# EAGLE design SwitchPi-v0.1 (EAGLE 6.4)
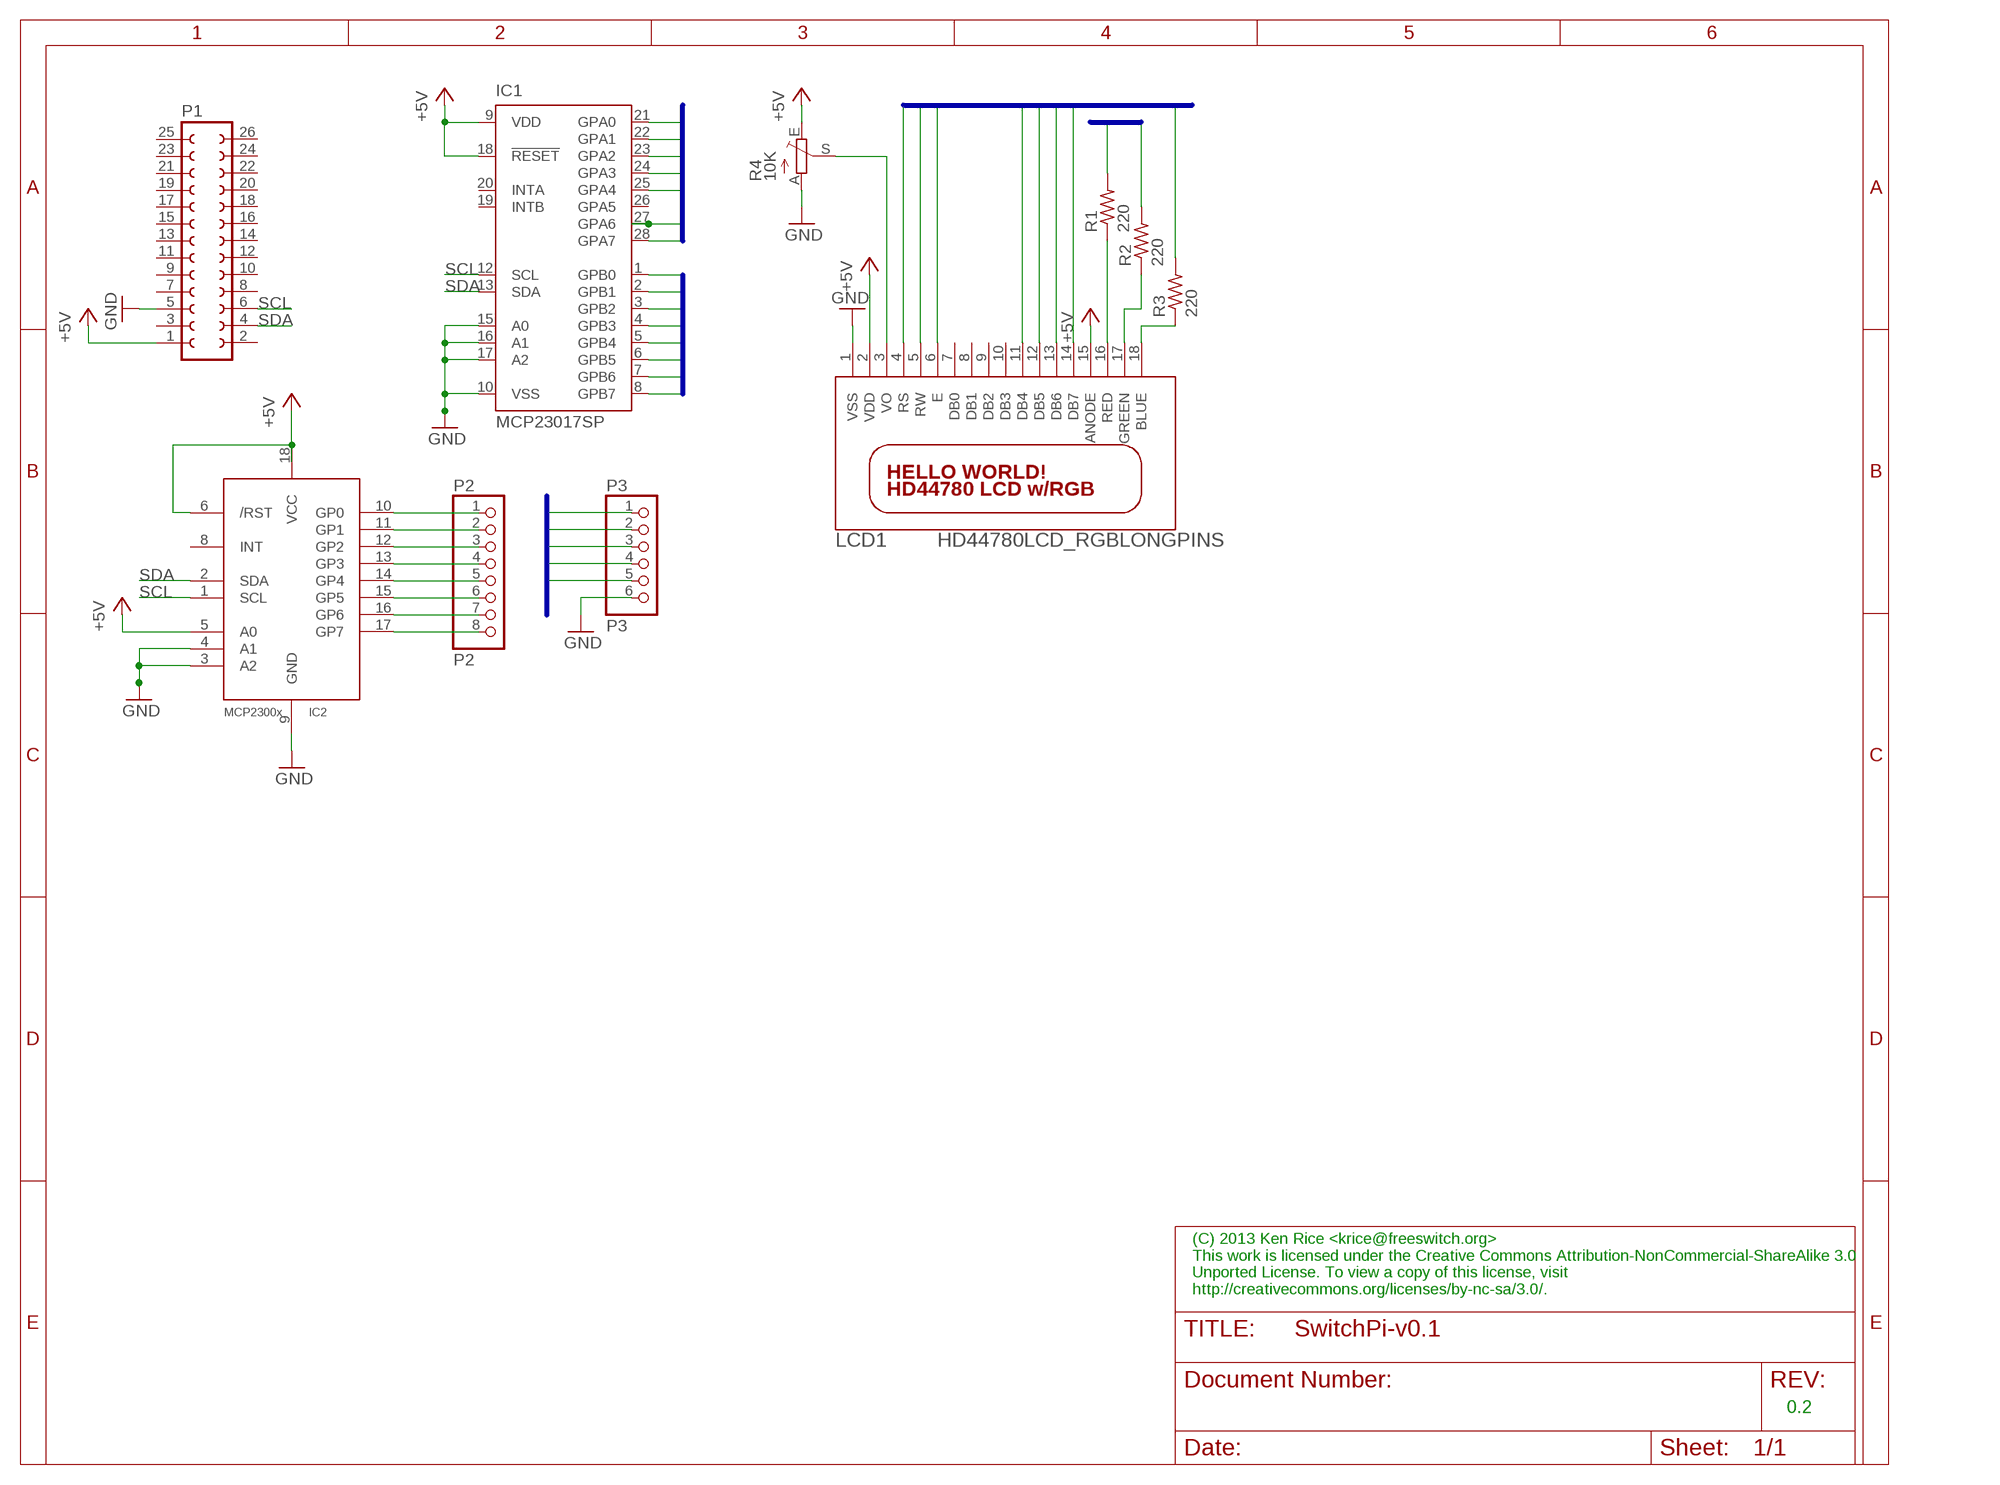
[diagram p0: schematic, sheet 1]

## Parts
IC1  MCP23017SP  [DIL28-3]
IC2  MCP2300X/P  [DIL18]
LCD1  HD44780LCD_RGBLONGPINS  [LCD1602-RGB]
P1  FE13-2  [FE13-2]
P2  P2  PINHD-1X8BIG  [1X08-BIG]
P3  P3  PINHD-1X6  [1X06]
R1  220  R-US_0207/10  [0207/10]
R2  220  R-US_0207/10  [0207/10]
R3  220  R-US_0207/10  [0207/10]
R4  10K  TRIM_EU-CA6V  [CA6V]

## Nets
+5V: IC1.9(VDD) IC1.18(!RESET) IC2.5(A0) IC2.6(/RST) IC2.18(VCC) LCD1.2(VDD) LCD1.15(ANODE) P1.1 R4.E
GND: IC1.10(VSS) IC1.15(A0) IC1.16(A1) IC1.17(A2) IC2.3(A2) IC2.4(A1) IC2.9(GND) LCD1.1(VSS) P1.5 P3.6 R4.A
GPA0: IC1.21(GPA0) P3.1
GPA1: IC1.22(GPA1) P3.2
GPA2: IC1.23(GPA2) P3.3
GPA3: IC1.24(GPA3) P3.4
GPA4: IC1.25(GPA4) P3.5
GPA6: IC1.27(GPA6) R1.2
GPA7: IC1.28(GPA7) R2.2
GPB0: IC1.1(GPB0) R3.2
GPB1: IC1.2(GPB1) LCD1.14(DB7)
GPB2: IC1.3(GPB2) LCD1.13(DB6)
GPB3: IC1.4(GPB3) LCD1.12(DB5)
GPB4: IC1.5(GPB4) LCD1.11(DB4)
GPB5: IC1.6(GPB5) LCD1.6(E)
GPB6: IC1.7(GPB6) LCD1.5(RW)
GPB7: IC1.8(GPB7) LCD1.4(RS)
N$1: IC2.10(GP0) P2.1
N$2: IC2.11(GP1) P2.2
N$3: LCD1.3(VO) R4.S
N$4: IC2.12(GP2) P2.3
N$5: LCD1.16(RED) R1.1
N$6: IC2.13(GP3) P2.4
N$7: IC2.14(GP4) P2.5
N$8: IC2.15(GP5) P2.6
N$9: IC2.16(GP6) P2.7
N$10: IC2.17(GP7) P2.8
N$13: LCD1.17(GREEN) R2.1
N$14: LCD1.18(BLUE) R3.1
SCL: IC1.12(SCL) IC2.1(SCL) P1.6
SDA: IC1.13(SDA) IC2.2(SDA) P1.4
Unconnected: IC1.19(INTB) IC1.20(INTA) IC1.26(GPA5) IC2.8(INT) LCD1.7(DB0) LCD1.8(DB1) LCD1.9(DB2) LCD1.10(DB3) P1.2 P1.3 P1.7 P1.8 P1.9 P1.10 P1.11 P1.12 P1.13 P1.14 P1.15 P1.16 P1.17 P1.18 P1.19 P1.20 P1.21 P1.22 P1.23 P1.24 P1.25 P1.26

## Buses
GPA[0..7]
GPB[0..7]

## Notes on the sheet
- (C) 2013 Ken Rice <krice@freeswitch.org>
  This work is licensed under the Creative Commons Attribution-NonCommercial-ShareAlike 3.0 
  Unported License. To view a copy of this license, visit
  http://creativecommons.org/licenses/by-nc-sa/3.0/.
- 0.2

## Library data of the parts
IC1 = microchip:MCP23017: http://ww1.microchip.com/downloads/en/DeviceDoc/21952a.pdf Source: http://ww1.microchip.com/downloads/en/DeviceDoc/21952a.pdf; MF: MICROCHIP; MPN: MCP23017-E/SP; OC_FARNELL: 1332088; OC_NEWARK: 31K2959
IC2 = adafruit:MCP2300X: MCP23008 Inexpensive i2c i/o expander - 8 general purpose i/o pins with optional pullups
LCD1 = adafruit:HD44780LCD_RGB
P1 = con-lsta:FE13-2: FEMALE HEADER; OC_FARNELL: unknown; OC_NEWARK: unknown
P2 = adafruit:PINHD-1X8: PIN HEADER
P3 = adafruit:PINHD-1X6: PIN HEADER
R1-R3 = resistor:R-US_: RESISTOR, American symbol
R4 = pot:TRIM_EU-: POTENTIOMETER

## Board
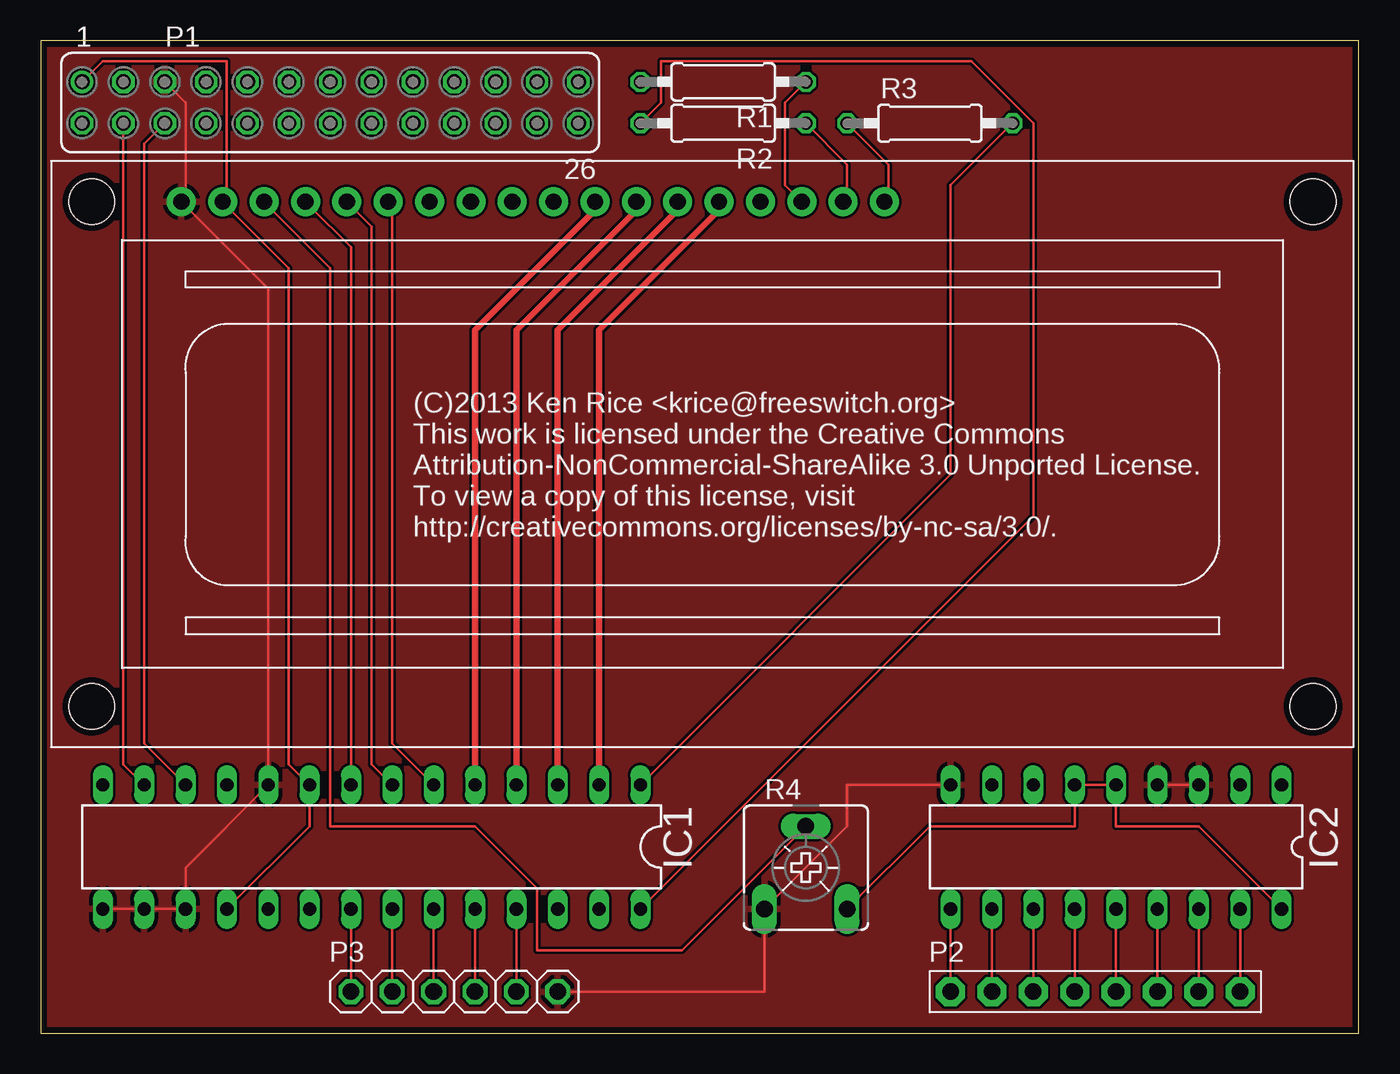
[diagram p1: board, top side]
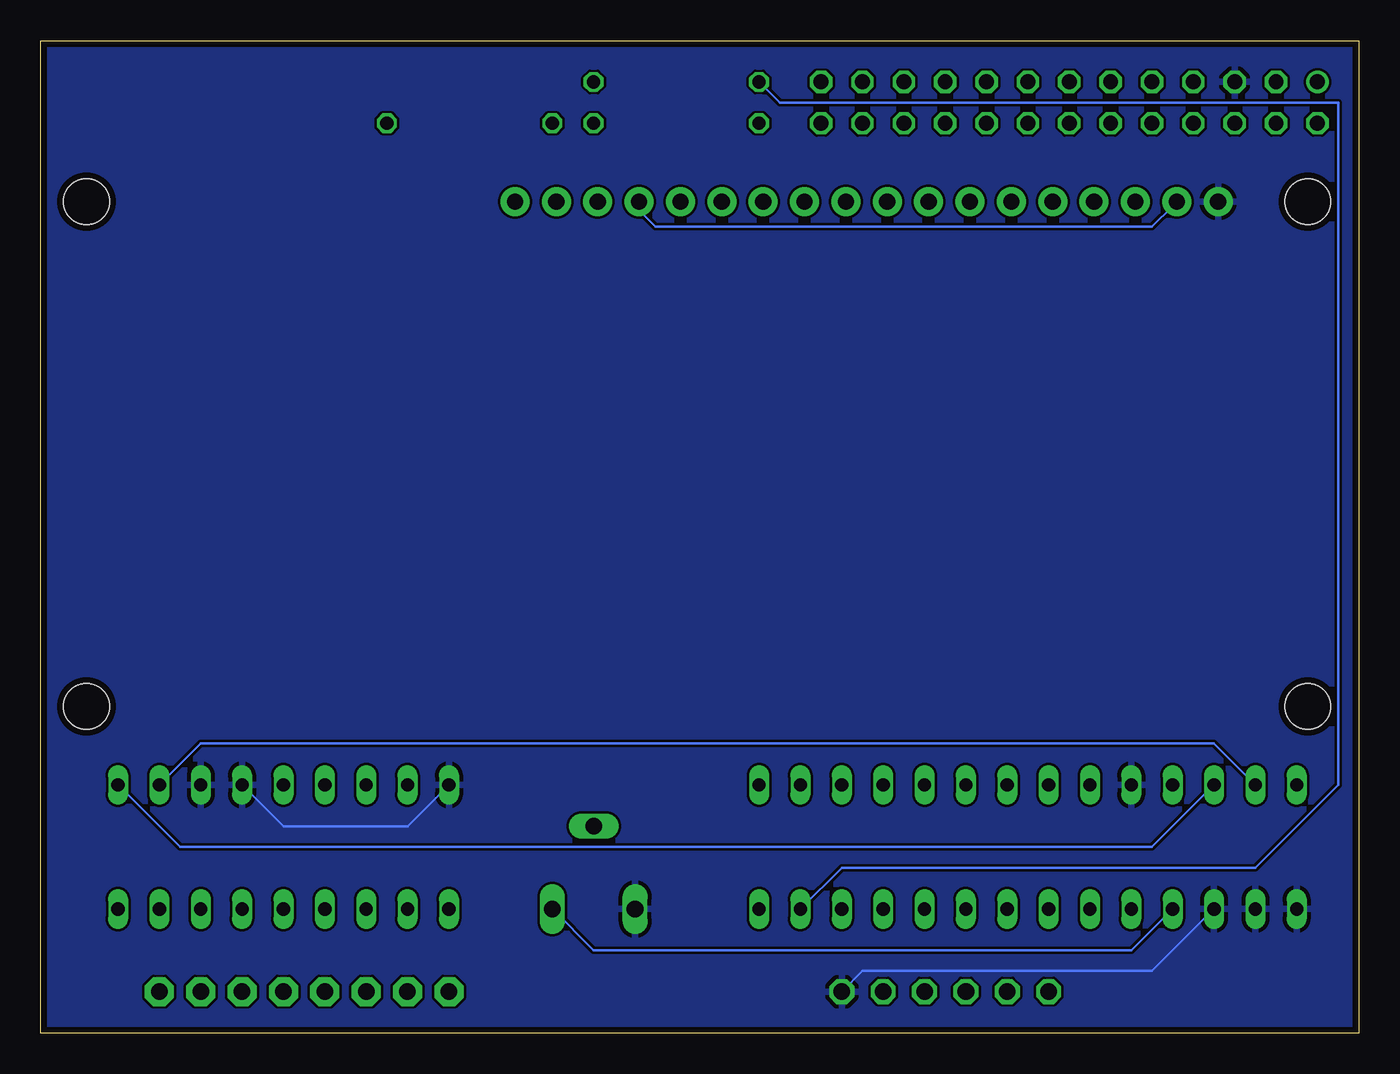
[diagram p2: board, bottom side, seen from below]

Size 80.95 x 60.95 mm. Coordinates in mm from the lower left corner, seen from the top.
Outline: 0,0 80.95,0 80.95,60.95 0,60.95 0,0
Copper layers (1*16): Top 0.0356mm / dielectric 1.5011mm / Bottom 0.0356mm
Design rules "LaenPCBOrder": minimum track width 6mil, minimum drill 13mil, track to track 6mil, track to pad 6mil, pad to pad 6mil, via to via 6mil, smd to smd 6mil, copper to edge 15mil, drill to drill 6mil, minimum pad ring 7mil, minimum via ring 7mil, stop-mask expansion 4mil, vias tented up to drill 0mil, thermal gap 10mil

### Footprints (pad centres in the part's own frame; a part is rotated, then mirrored left to right if it is on the bottom)
DIL28-3 = drill 0.813 long: 1 -16.51,-3.81; 2 -13.97,-3.81; 3 -11.43,-3.81; 4 -8.89,-3.81; 5 -6.35,-3.81; 6 -3.81,-3.81; 7 -1.27,-3.81; 8 1.27,-3.81; 9 3.81,-3.81; 10 6.35,-3.81; 11 8.89,-3.81; 12 11.43,-3.81; 13 13.97,-3.81; 14 16.51,-3.81; 15 16.51,3.81; 16 13.97,3.81; 17 11.43,3.81; 18 8.89,3.81; 19 6.35,3.81; 20 3.81,3.81; 21 1.27,3.81; 22 -1.27,3.81; 23 -3.81,3.81; 24 -6.35,3.81; 25 -8.89,3.81; 26 -11.43,3.81; 27 -13.97,3.81; 28 -16.51,3.81
DIL18 = drill 0.813 long: 1 -10.16,-3.81; 2 -7.62,-3.81; 3 -5.08,-3.81; 4 -2.54,-3.81; 5 0,-3.81; 6 2.54,-3.81; 7 5.08,-3.81; 8 7.62,-3.81; 9 10.16,-3.81; 10 10.16,3.81; 11 7.62,3.81; 12 5.08,3.81; 13 2.54,3.81; 14 0,3.81; 15 -2.54,3.81; 16 -5.08,3.81; 17 -7.62,3.81; 18 -10.16,3.81
LCD1602-RGB = drill 1 pad 1.778: 1 -32,15.5; 2 -29.46,15.5; 3 -26.92,15.5; 4 -24.38,15.5; 5 -21.84,15.5; 6 -19.3,15.5; 7 -16.76,15.5; 8 -14.22,15.5; 9 -11.68,15.5; 10 -9.14,15.5; 11 -6.6,15.5; 12 -4.06,15.5; 13 -1.52,15.5; 14 1.02,15.5; 15 3.56,15.5; 16 6.1,15.5; 17 8.64,15.5; 18 11.18,15.5 | hole 2.8: -37.5,-15.5; -37.5,15.5; 37.5,15.5; 37.5,-15.5
FE13-2 = drill 0.914: 1 -15.24,1.27 | drill 0.914 octagon: 2 -15.24,-1.27; 3 -12.7,1.27; 4 -12.7,-1.27; 5 -10.16,1.27; 6 -10.16,-1.27; 7 -7.62,1.27; 8 -7.62,-1.27; 9 -5.08,1.27; 10 -5.08,-1.27; 11 -2.54,1.27; 12 -2.54,-1.27; 13 0,1.27; 14 0,-1.27; 15 2.54,1.27; 16 2.54,-1.27; 17 5.08,1.27; 18 5.08,-1.27; 19 7.62,1.27; 20 7.62,-1.27; 21 10.16,1.27; 22 10.16,-1.27; 23 12.7,1.27; 24 12.7,-1.27; 25 15.24,1.27; 26 15.24,-1.27
1X08-BIG = drill 1.016 pad 1.778 octagon: 1 -8.89,0; 2 -6.35,0; 3 -3.81,0; 4 -1.27,0; 5 1.27,0; 6 3.81,0; 7 6.35,0; 8 8.89,0
1X06 = drill 1.016 octagon: 1 -6.35,0; 2 -3.81,0; 3 -1.27,0; 4 1.27,0; 5 3.81,0; 6 6.35,0
0207/10 = drill 0.813 octagon: 1 -5.08,0; 2 5.08,0
CA6V = drill 1.016 long: A -2.54,-2.54; E 2.54,-2.54; S 0,2.54

### Placement (x,y rotation side)
IC1  20.32,11.43 180 top
IC2  66.04,11.43 180 top
LCD1  40.64,35.56 0 top
P1  17.78,57.15 0 top
P2  64.77,2.54 0 top
P3  25.4,2.54 0 top
R1  41.91,58.42 180 top
R2  41.91,55.88 180 top
R3  54.61,55.88 0 top
R4  46.99,10.16 0 top

### Tracks (layer width: path | path; a pad name or v marks a point on that pad's centre or on a via)
+5V
  Top 0.152: IC2.18 71.12,12.7 66.04,12.7 IC2.5 IC2.6 63.5,12.7 54.61,12.7 R4.E | IC1.18 16.51,12.7 IC1.9 15.24,16.51 15.24,46.99 11.43,50.8 | P1.1 3.81,59.69 11.43,59.69 11.43,50.8 | 11.43,50.8 LCD1.2
  Bottom 0.152: LCD1.15 44.45,50.8 43.18,49.53 12.7,49.53 11.43,50.8 LCD1.2 | R4.E 46.99,5.08 13.97,5.08 IC1.18
GND
  Top 0.152: IC2.4 IC2.3 | P3.6 44.45,2.54 R4.A 49.53,12.7 49.53,15.24 IC2.9 | P1.5 8.89,57.15 8.89,50.8 | IC1.15 IC1.16 IC1.17 8.89,10.16 IC1.10 13.97,45.72 8.89,50.8 | 8.89,50.8 LCD1.1
  Bottom 0.152: IC2.9 58.42,12.7 66.04,12.7 IC2.4 | P3.6 30.48,3.81 12.7,3.81 IC1.17
  pour Top: 0,60.96 81.28,60.96 81.28,0 0,0
  pour Bottom: 0,60.96 81.28,60.96 81.28,0 0,0
GPA0
  Top 0.152: P3.1 IC1.21
GPA1
  Top 0.152: P3.2 IC1.22
GPA2
  Top 0.152: P3.3 IC1.23
GPA3
  Top 0.152: P3.4 IC1.24
GPA4
  Top 0.152: P3.5 IC1.25
GPA6
  Bottom 0.152: IC1.27 31.75,10.16 6.35,10.16 1.27,15.24 1.27,57.15 35.56,57.15 R1.2
GPA7
  Top 0.152: IC1.28 60.96,31.75 60.96,55.88 57.15,59.69 38.1,59.69 38.1,57.15 R2.2
GPB0
  Top 0.152: IC1.1 55.88,34.29 55.88,52.07 R3.2
GPB1
  Top 0.406: LCD1.14 41.66,50.55 34.29,43.18 IC1.2
GPB2
  Top 0.406: LCD1.13 39.12,50.55 31.75,43.18 IC1.3
GPB3
  Top 0.406: LCD1.12 36.58,50.55 29.21,43.18 IC1.4
GPB4
  Top 0.406: LCD1.11 34.04,50.55 26.67,43.18 IC1.5
GPB5
  Top 0.152: IC1.6 21.59,17.78 21.59,50.8 LCD1.6
GPB6
  Top 0.152: IC1.7 20.32,16.51 20.32,49.53 19.05,50.8 LCD1.5
GPB7
  Top 0.152: IC1.8 19.05,48.26 16.51,50.8 LCD1.4
N$1
  Top 0.152: P2.1 IC2.10
N$2
  Top 0.152: P2.2 IC2.11
N$3
  Top 0.152: R4.S 39.37,5.08 30.48,5.08 30.48,8.89 26.67,12.7 17.78,12.7 17.78,46.99 13.97,50.8 LCD1.3
N$4
  Top 0.152: P2.3 IC2.12
N$5
  Top 0.152: R1.1 45.72,57.15 45.72,52.07 46.99,50.8 LCD1.16
N$6
  Top 0.152: P2.4 IC2.13
N$7
  Top 0.152: P2.5 IC2.14
N$8
  Top 0.152: P2.6 IC2.15
N$9
  Top 0.152: P2.7 IC2.16
N$10
  Top 0.152: P2.8 IC2.17
N$13
  Top 0.152: R2.1 49.53,53.34 49.53,50.8 LCD1.17
N$14
  Top 0.152: R3.1 52.07,53.34 52.07,50.8 LCD1.18
SCL
  Top 0.152: IC1.12 6.35,17.78 6.35,54.61 P1.6
  Bottom 0.152: IC2.1 72.39,11.43 12.7,11.43 IC1.12
SDA
  Top 0.152: IC1.13 5.08,16.51 P1.4
  Bottom 0.152: IC2.2 71.12,17.78 8.89,17.78 IC1.13

### Text on the board
tSilk: (C)2013 Ken Rice <krice@freeswitch.org> / This work is licensed under the Creative Commons / Attribution-NonCommercial-ShareAlike 3.0 Unported License. / To view a copy of this license, visit / http://creativecommons.org/licenses/by-nc-sa/3.0/.